# Altium schematic sheet Pomiar-Energii_A4_Landscape_.SchDoc
size A4; Author: Michał Berdzik; CompanyName: AGH
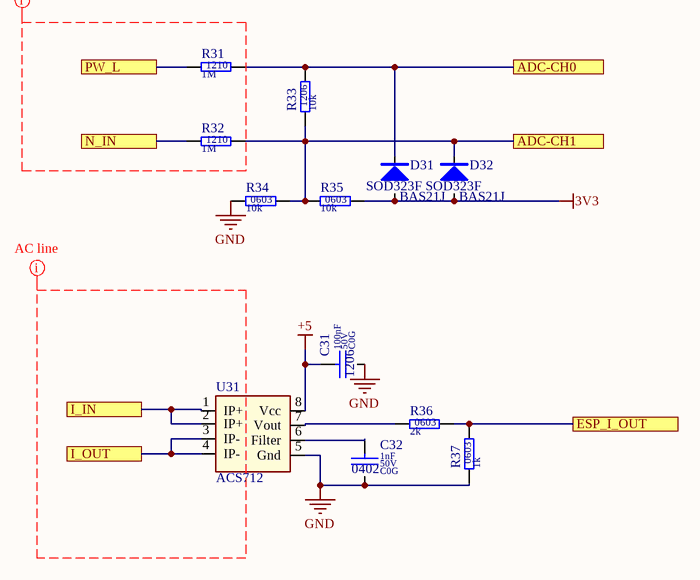
[diagram p0: Pomiar-Energii_A4_Landscape_.SchDoc]

## Parts
C31  value 100nF  Dielectric: C0G  Voltage: 50V  SCH_Footprint: 1206  [C_1206_3216]  (hidden comment: Ceramic C0G)
C32  value 1nF  Dielectric: C0G  Voltage: 50V  SCH_Footprint: 0402  [C_0402_1005]  (hidden comment: Ceramic C0G)
D31  BAS21J  [SOD323F]
D32  BAS21J  [SOD323F]
R31  value 1M  SCH_Footprint: 1210  [R_1210_3225]  (hidden comment: Resistor)
R32  value 1M  SCH_Footprint: 1210  [R_1210_3225]  (hidden comment: Resistor)
R33  value 10k  SCH_Footprint: 1206  [R_1206_3216]  (hidden comment: Resistor)
R34  value 10k  SCH_Footprint: 0603  [R_0603_1608]  (hidden comment: Resistor)
R35  value 10k  SCH_Footprint: 0603  [R_0603_1608]  (hidden comment: Resistor)
R36  value 2k  SCH_Footprint: 0603  [R_0603_1608]  (hidden comment: Resistor)
R37  value 1k  SCH_Footprint: 0603  [R_0603_1608]  (hidden comment: Resistor)
U31  ACS712  [ACS712]

## Ports
ADC-CH0, ADC-CH1, ESP_I_OUT, I_IN, I_OUT, N_IN, PW_L

## Nets
3V3: D31.2 D32.2 R35.2
+5: C31.1 U31.8(Vcc)
GND: C31.2 C32.2 R34.1 R37.1 U31.5(Gnd)
ADC-CH0: D31.1 R31.2 R33.2 ; port ADC-CH0
ADC-CH1: D32.1 R32.2 R33.1 R34.2 R35.1 ; port ADC-CH1
ESP_I_OUT: R36.2 R37.2 ; port ESP_I_OUT
I_IN: U31.1(IP+) U31.2(IP+) ; port I_IN
I_OUT: U31.3(IP-) U31.4(IP-) ; port I_OUT
N_IN: R32.1 ; port N_IN
PW_L: R31.1 ; port PW_L
NetC32_1: C32.1 U31.6(Filter)
NetR36_1: R36.1 U31.7(Vout)

## Layout directives
rule Width Constraint [Pref Width = 40mil    Min Width = 30mil    Max Width = 50mil]; rule Clearance Constraint [Clearance = 0.4mm]: (no net found under the mark)

## Notes on the sheet
- Nazwa uczelni: <Company Name>
- Nazwisko konstruktora:

## Library data of the parts
C31 = C_100nF_50V_C0G_1206_5: Capacitor; Manufacturer: Walsin; Manufacturer Part Number: 1206N104J500; Tolerance (%): 5; Part Number: C_100nF_50V_C0G_1206_5; HelpURL: http://www.tme.eu/pl/Document/b889b06af04308cca2dc1b1bfdff29a5/Middle_and_High_Voltage_DS.pdf; Supplier 1: TME; Supplier Part Number 1: 1206N104J500; Supplier 2: RS Components; Supplier 3: Farnell; Supplier 4: Mouser; Supplier 5: Digi-Key
C32 = C_1nF_50V_C0G_0402_5: Capacitor; Manufacturer: Murata; Manufacturer Part Number: GRM1555C1H102JA01D; Tolerance (%): 5; Part Number: C_1nF_50V_C0G_0402_5; HelpURL: http://www.tme.eu/en/Document/e3e731e59cc68b1ab6d46b158bb05733/MURATA_GRM.pdf; Supplier 1: TME; Supplier Part Number 1: GRM1555C1H102JA01D; Supplier 2: RS Components; Supplier Part Number 2: 6242913; Supplier 3: Farnell; Supplier Part Number 3: 2408520; Supplier 4: Mouser; Supplier Part Number 4: 81-GRM1555C1H102JA1D; Supplier 5: Digi-Key; Supplier Part Number 5: 490-3244-1-ND
D31 D32 = D_BAS21J_0A25_300V_SOD323F: Manufacturer: nexperia; Voltage: 300V; Current: 0.25A; SCH_Footprint: SOD323F; Value: BAS21J; Part Number: D_BAS21J_0A25_300V_SOD323F; HelpURL: http://www.farnell.com/datasheets/1383268.pdf; Manufacturer Part Number: BAS21J; Supplier 1: TME; Supplier Part Number 1: BAS21J.115; Supplier 2: RS Components; Supplier 3: Farnell; Supplier Part Number 3: 1907600; Supplier 4: Mouser; Supplier Part Number 4: 771-BAS21J115; Supplier 5: Digi-Key; Supplier Part Number 5: 1727-4799-1-ND
R31 R32 = R_1M_1210_1: Manufacturer: Panasonic; Manufacturer Part Number: ERJ-14NF1004U; Voltage: 200V; Power: 500mW; Tolerance: 1%; Part Number: R_1M_1210_1; HelpURL: http://www.farnell.com/datasheets/1911175.pdf?_ga=2.207341461.740974696.1547129502-1379097396.1542296996&_gac=1.259826424.1547131642.CjwKCAiA99vhBRBnEiwAwpk-uF9FH0QOBtmnC0R25qOd4MzGcDpshEvSsyyBD6uWM-Xs8IEw4YE-8RoCRw0QAvD_BwE; Supplier 1: TME; Supplier 2: RS Components; Supplier 3: Farnell; Supplier Part Number 3: 2323882; Supplier 4: Mouser; Supplier Part Number 4: 667-ERJ-14NF1004U; Supplier 5: Digi-Key; Supplier Part Number 5: P1.00MAACT-ND
R33 = R_10k_1206_1: Manufacturer: Royalohm; Manufacturer Part Number: CQ06S4F1202T5E; Voltage: 200V; Power: 125mW; Tolerance: 1%; Part Number: R_10k_1206_1; HelpURL: https://www.tme.eu/pl/Document/ec37243ca557adb02ebafc5c1ab83104/CQ%20datasheet.pdf; Supplier 1: TME; Supplier Part Number 1: CQ1206-12K-1%; Supplier 2: RS Components; Supplier 3: Farnell; Supplier 4: Mouser; Supplier 5: Digi-Key
R34 R35 = R_10k_0603_1: Manufacturer: Vishay; Manufacturer Part Number: CRCW060310K0FKTABC; Voltage: 75V; Power: 100mW; Tolerance: 1%; Part Number: R_10k_0603_1; HelpURL: http://www.tme.eu/pl/Document/622e28308c06d160637f2b14751ba16b/Data%20Sheet%20CRCW_BCe3.pdf; Supplier 1: TME; Supplier Part Number 1: CRCW060310K0FKTABC; Supplier 2: RS Components; Supplier 3: Farnell; Supplier 4: Mouser; Supplier Part Number 4: 667-ERJ-3EKF1002V; Supplier 5: Digi-Key; Supplier Part Number 5: P10KGCT-ND
R36 R37 = R_2k_0603: Manufacturer: Yageo; Manufacturer Part Number: RC0603FR-072KL; Power: 100mW; Tolerance: 1%; Part Number: R_2k_0603; HelpURL: http://datasheet.octopart.com/RC0603FR-072KL-Yageo-datasheet-8328172.pdf; Supplier 1: TME; Supplier Part Number 1: RC0603FR-072K; Supplier 2: RS Components; Supplier 3: Farnell; Supplier Part Number 3: 1799328; Supplier 4: Mouser; Supplier Part Number 4: 603-RC0603FR-072KL; Supplier 5: Digi-Key; Supplier Part Number 5: 311-2.00KHRCT-ND
U31 = ACS712: Value: *; SupplierPartNumber: *; Supplier: *